# Altium schematic sheet i2c pullups.SchDoc
size A4
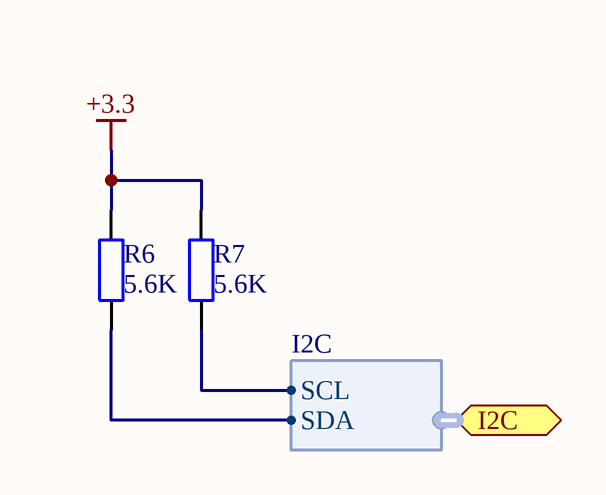
[diagram p0: i2c pullups.SchDoc]

## Parts
R6  value 5.6K  [R0603]  (hidden comment: Res2)
R7  value 5.6K  [R0603]  (hidden comment: Res2)

## Ports
I2C (harness I2C)

## Harnesses
I2C: SCL, SDA

## Nets
+3.3: R6.2 R7.2
NetR6_1: R6.1 ; port I2C.SDA
NetR7_1: R7.1 ; port I2C.SCL

## Library data of the parts
R6 R7 = Res2: Resistor; Published: 8-Jun-2000; LatestRevisionDate: 17-Jul-2002; LatestRevisionNote: Re-released for DXP Platform.; PackageReference: AXIAL-0.4; Publisher: Altium Limited; farnell: 2074283